# Altium project Fan_Board.PrjPcb
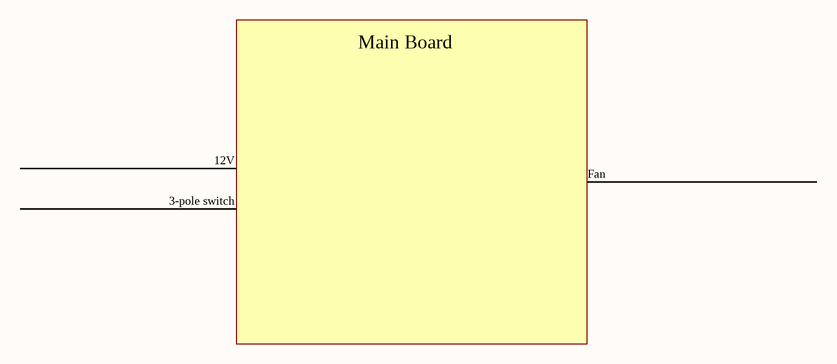
[diagram p0: Block_Diagram.SchDoc]
ProjectAuthor: John Webster and Vlad Hociota; ProjectRevision: 1.0
2 sheets, 9 parts. Net scope: global (net labels, ports and power ports of the same name join across sheets).
Board file: MSXII_Fan_Control.PcbDoc
Sheets:
  Block_Diagram.SchDoc
  Fan_Board.SchDoc

## Sheet Block_Diagram.SchDoc: Block Diagram
size Letter; Organization: Midnight Sun Solar Rayce Car Team; Address1: University of Waterloo; Address2: 200 University Ave W; Address3: Waterloo, ON, Canada; Address4: N2L 3E9; DocumentNumber: 1; SheetNumber: 1; SheetTotal: 5; Website: www.uwmidsun.com

### Notes on the sheet
- Main Board
- 12V
- 3-pole switch
- Fan
- Project:
- Title:
- Size:
- Project Lead:
- Letter
- Revision:
- University of Waterloo
- 200 University Ave W
- Waterloo, ON, Canada
- N2L 3E9
- Date:
- Sheet
- of
- Website:

## Sheet Fan_Board.SchDoc: Fan Control Board
size Letter; DocumentNumber: 3; Revision: 1.0; SheetNumber: 1; SheetTotal: 1; Website: www.uwmidsun.com
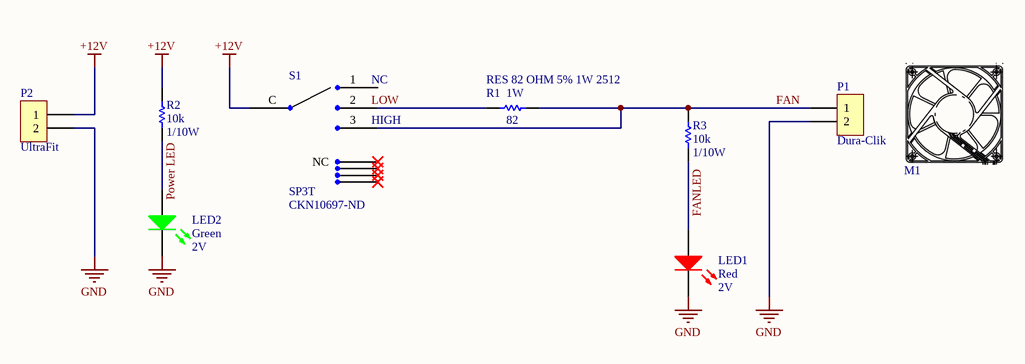
[diagram p1: Fan_Board.SchDoc]

### Parts
LED1  Color: Red  Voltage - Forward (Vf) (Typ): 2V  [LED_0603]  (hidden comment: LED RED CLEAR 2V 0603)
LED2  Color: Green  Voltage - Forward (Vf) (Typ): 2V  [LED_0603]  (hidden comment: LED GREEN CLEAR 2V 0603)
M1  FAN 0.03A 12VDC  (value not drawn)
P1  Dura-Clik  [CONN, 2POS Dura-Click Vertical]
P2  Series: UltraFit  [CONN, 2POS ULTRA-FIT]  (hidden comment: CONN 2POS ULTRA-FIT 0.138")
R1  RES 82 OHM 5% 1W 2512  [RES2512]
R2  Resistance: 10k  Power: 1/10W  [RES, 0603]  (hidden comment: RES 10K OHM 1% 1/10W 0603)
R3  Resistance: 10k  Power: 1/10W  [RES, 0603]  (hidden comment: RES 10K OHM 1% 1/10W 0603)
S1  SP3T  Supplier Part Number 1: CKN10697-ND  [SW ROT RM SERIES]

### Nets
+12V: P2.1 R2.1 S1.C
GND: LED1.2(K) LED2.2(K) P1.2 P2.2
FAN: P1.1 R1.1 R3.1 S1.3
FANLED: LED1.1(A) R3.2
Power LED: LED2.1(A) R2.2
NetR1_2: R1.2 S1.2

Not connected (* = marked no-connect by the designer): S1 1(5) NC*

### Notes on the sheet
- (near S1) NC
- (near S1) HIGH
- Labels drawn without touching a wire or pin: LOW
- Project:
- Title:
- Size:
- Project Lead:
- Letter
- Revision:
- University of Waterloo
- 200 University Ave W
- Waterloo, ON, Canada
- N2L 3E9
- Date:
- Sheet
- of
- Website:
- (in symbol RES 82 OHM 5% 1W 2512) 1W; 82

### Library data of the parts
LED1 = LED RED CLEAR 2V 0603: Red 631nm LED Indication - Discrete 2V 0603 (1608 Metric); Manufacturer: Wurth Electronics Inc.; Manufacturer Part Number: 150060RS75000; Lens Color: Colorless; Millicandela Rating: 250mcd; Lens Style/Size: Rectangle with Flat Top, 1.10mm x 0.70mm; Current - Test: 20mA; Viewing Angle: 140°; Wavelength - Dominant: 625nm; Wavelength - Peak: 630nm; Supplier 1: Digi-Key; RoHS: RoHS Compliant; Category: Optoelectronics; Stock 1: 35521; Pricing 1: 1=0.21, 100=0.1617, 500=0.13964 (CAD); Packaging: Cut Tape (CT); Part Status: Active; Lens Transparency: Clear; Mounting Type: Surface Mount; Features: -; Package / Case: 0603 (1608 Metric); Supplier Device Package: 0603; Size / Dimension: 1.60mm L x 0.80mm W; Height (Max): 0.80mm; ComponentLink1URL: http://katalog.we-online.de/led/datasheet/150060RS75000.pdf; ComponentLink1Description: http://katalog.we-online.de/led/datasheet/150060RS75000.pdf; Supplier Part Number 1: 732-4978-1-ND
LED2 = LED GREEN CLEAR 2V 0603: Green 572nm LED Indication - Discrete 2V 0603 (1608 Metric); Manufacturer: Wurth Electronics Inc.; Manufacturer Part Number: 150060VS75000; Lens Color: Colorless; Millicandela Rating: 40mcd; Lens Style/Size: Rectangle with Flat Top, 1.10mm x 0.70mm; Current - Test: 20mA; Viewing Angle: 140°; Wavelength - Dominant: 570nm; Supplier 1: Digi-Key; RoHS: RoHS Compliant; Category: Optoelectronics; Stock 1: 9408; Pricing 1: 1=0.21, 100=0.1617, 500=0.13964 (CAD); Packaging: Cut Tape (CT); Part Status: Active; Lens Transparency: Clear; Mounting Type: Surface Mount; Wavelength - Peak: 572nm; Features: -; Package / Case: 0603 (1608 Metric); Supplier Device Package: 0603; Size / Dimension: 1.60mm L x 0.80mm W; Height (Max): 0.80mm; ComponentLink1URL: http://katalog.we-online.de/led/datasheet/150060VS75000.pdf; ComponentLink1Description: http://katalog.we-online.de/led/datasheet/150060VS75000.pdf; Supplier Part Number 1: 732-4980-1-ND
M1 = FAN 0.03A 12VDC: FAN 0.03A 12VDC 2 WIRE; Manufacturer: Sunon; Manufacturer Part Number: HA40201V4-1000U-A99; Supplier 1: Digi-Key; RoHS: Yes; Stock 1: 1054; Pricing 1: 1 = 4.34000, 10 = 3.97700, 25 = 3.61520, 50 = 3.34420, 100 = 2.98260, 250 = 2.84708, 500 = 2.66630 (USD); ComponentLink1URL: http://www.sunon.com/uFiles/file/03_products/08-catalog%20download/Sunon%20DC%20Brushless%20Fan%20&%20Blower_(240-E).pdf?src-supplier=Digi-Key; ComponentLink1Description: http://www.sunon.com/uFiles/file/03_products/08-catalog%20download/Sunon%20DC%20Brushless%20Fan%20&%20Blower_(240-E).pdf?src-supplier=Digi-Key; Supplier Part Number 1: 259-1791-ND
P1 = CONN 2POS DURA-CLIK 0.079" VERT: 2 Positions Header, Shrouded Connector 0.079" (2.00mm) Surface Mount, Vertical Tin; Manufacturer: Molex, LLC; Manufacturer Part Number: 5600200220; Style: Board to Cable/Wire; Shrouding: Shrouded - 4 Wall; Number of Positions: 2; Number of Positions Loaded: All; Mated Stacking Heights: 9.3mm; Supplier 1: Digi-Key; RoHS: RoHS Compliant; Category: Connectors, Interconnects; Stock 1: 11912; Pricing 1: 1=1.16, 10=1.012, 25=0.952, 50=0.9122, 100=0.8727, 250=0.79336 (CAD); Packaging: Cut Tape (CT); Part Status: Active; Connector Type: Header; Contact Type: Male Pin; Pitch - Mating: 0.079" (2.00mm); Number of Rows: 1; Row Spacing - Mating: -; Mounting Type: Surface Mount; Termination: Solder; Fastening Type: Latch Lock; Contact Length - Mating: -; Contact Length - Post: -; Overall Contact Length: -; Insulation Height: 0.315" (8.00mm); Contact Shape: Square; Contact Finish - Mating: Tin; Contact Finish Thickness - Mating: -; Contact Finish - Post: Tin; Contact Material: Copper Alloy; Insulation Material: Polyamide (PA), Nylon; Features: Solder Retention; Operating Temperature: -; Ingress Protection: -; Material Flammability Rating: -; Insulation Color: Natural; Current Rating: -; Voltage Rating: -; Contact Finish Thickness - Post: -; Applications: Automotive, Industrial; ComponentLink1URL: http://www.molex.com/pdm_docs/sd/5600200220_sd.pdf; ComponentLink1Description: http://www.molex.com/pdm_docs/sd/5600200220_sd.pdf; Supplier Part Number 1: WM10862CT-ND
P2 = CONN 2POS ULTRA-FIT 0.138": 2 Positions Header, Shrouded Connector 0.138" (3.50mm) Through Hole Gold; Manufacturer 1: Molex, LLC; Manufacturer Part Number 1: 1722861302; Style: Board to Board or Cable; Shrouding: Shrouded - 4 Wall; Number of Positions: 2; Number of Positions Loaded: All; Contact Length - Post: 0.126" (3.20mm); Material Flammability Rating: UL94 V-0; Mated Stacking Heights: 26.99mm; Voltage: 400V; Supplier 1: Digi-Key; Supplier Part Number 1: WM11673-ND; Packaging: Tray; Part Status: Active; Connector Type: Header; Contact Type: Male Pin; Pitch - Mating: 0.138" (3.50mm); Number of Rows: 1; Row Spacing - Mating: -; Mounting Type: Through Hole; Termination: Kinked Pin, Solder; Fastening Type: Latch Holder; Contact Length - Mating: -; Overall Contact Length: -; Insulation Height: 0.465" (11.80mm); Contact Shape: Square; Contact Finish - Mating: Gold; Contact Finish Thickness - Mating: 30µin (0.76µm); Contact Finish - Post: Tin; Contact Material: Copper Alloy; Insulation Material: Liquid Crystal Polymer (LCP); Operating Temperature: -40°C ~ 120°C; Ingress Protection: -; Insulation Color: Black; Current Rating: -; Contact Finish Thickness - Post: 60µin (1.52µm); ComponentLink1URL: http://www.molex.com/pdm_docs/sd/1722861302_sd.pdf; ComponentLink1Description: http://www.molex.com/pdm_docs/sd/1722861302_sd.pdf
R1 = RES 82 OHM 5% 1W 2512: Manufacturer: Panasonic; Manufacturer Part Number: ERJ-P06J820V; Resistance: 82R; Temperature Coefficient: 200ppm/°C; Voltage Rating: 150V; Power Rating: 500mW; RoHS: Yes; Mount: Surface Mount; Case/Package: 0805; Contact Plating: Tin; Case Code (Imperial): 0805; Case Code (Metric): 2012; Min Operating Temperature: -55°C; Max Operating Temperature: 155°C; Tolerance: 5%; Composition: Thick Film; Packaging: Tape and Reel; Package Quantity: 1; Number of Terminations: 2; Max Power Dissipation: 500mW; Voltage Rating (DC): 150V; Features: Automotive AEC-Q200; Length: 0.079inch; Height: 0.028inch; Width: 1.2mm; Radiation Hardening: No; Lead Free: Lead Free; ComponentLink1URL: https://datasheet.ciiva.com/24043/aoa0000ce4-64075-24043253.pdf?src-supplier=Mouser; ComponentLink1Description: https://datasheet.ciiva.com/24043/aoa0000ce4-64075-24043253.pdf?src-supplier=Mouser; ComponentLink2URL: https://datasheet.ciiva.com/30128/aoa0000ce4-30128246.pdf?src-supplier=Onlinecomponents.com; ComponentLink2Description: https://datasheet.ciiva.com/30128/aoa0000ce4-30128246.pdf?src-supplier=Onlinecomponents.com; ComponentLink3URL: https://datasheet.ciiva.com/9187/aoa0000ce4-9187530.pdf?src-supplier=Avnet; ComponentLink3Description: https://datasheet.ciiva.com/9187/aoa0000ce4-9187530.pdf?src-supplier=Avnet; Stock 1: 18769; Pricing 1: 1 = 0.30000, 10 = 0.25400, 100 = 0.09930, 1000 = 0.04158 (USD); Military Standard: Not; Depth: 3.2mm; ComponentLink4URL: http://components.arrow.com/part/dataview/46840453S9826188N1174?src-supplier=Arrow; ComponentLink4Description: http://components.arrow.com/part/dataview/46840453S9826188N1174?src-supplier=Arrow; ComponentLink5URL: https://www.verical.com/server-webapp/html/getDatasheet?partID=363751&src-supplier=Verical; ComponentLink5Description: https://www.verical.com/server-webapp/html/getDatasheet?partID=363751&src-supplier=Verical; ComponentLink6URL: https://www.seielect.com/Catalog/SEI-RMCF_RMCP.pdf?src-supplier=Digi-Key; ComponentLink6Description: https://www.seielect.com/Catalog/SEI-RMCF_RMCP.pdf?src-supplier=Digi-Key; ComponentLink7URL: https://www.seielect.com/catalog/SEI-RMCF_RMCP.pdf?src-supplier=Avnet; ComponentLink7Description: https://www.seielect.com/catalog/SEI-RMCF_RMCP.pdf?src-supplier=Avnet; ComponentLink8URL: http://www.seielect.com/Catalog/SEI-RMCF_RMCP.pdf?src-supplier=Future+Electronics; ComponentLink8Description: http://www.seielect.com/Catalog/SEI-RMCF_RMCP.pdf?src-supplier=Future+Electronics; Supplier 1: Digi-Key; Supplier Part Number 1: RMCF2512JT82R0CT-ND
R2 R3 = RES 10K OHM 1% 1/10W 0603: RES SMD 10K OHM 1% 1/10W 0603; Manufacturer 1: Yageo; Manufacturer Part Number 1: RC0603FR-0710KL; Temperature Coefficient: ±100ppm/°C; Supplier 1: Digi-Key; Supplier Part Number 1: 311-10.0KHRCT-ND; Packaging: Cut Tape (CT); Part Status: Active; Composition: Thick Film; Operating Temperature: -55°C ~ 155°C; Package / Case: 0603 (1608 Metric); Supplier Device Package: 0603; Size / Dimension: 0.063" L x 0.031" W (1.60mm x 0.80mm); Height - Seated (Max): 0.022" (0.55mm); Failure Rate: -; ComponentLink1URL: http://www.yageo.com/documents/recent/PYu-RC_Group_51_RoHS_L_7.pdf; ComponentLink1Description: http://www.yageo.com/documents/recent/PYu-RC_Group_51_RoHS_L_7.pdf; Tolerance: ±1%
S1 = SW ROT SP3T-NO 0.5A 24VDC: SWITCH ROTARY 3POS 500MA 24V; Manufacturer: ITT C&K; Manufacturer Part Number: RM103772BCB; Supplier 1: Digi-Key; Stock 1: 22; Pricing 1: 1 = 2.27000, 10 = 2.17400, 25 = 1.98520, 50 = 1.89080, 100 = 1.70160, 250 = 1.55984, 500 = 1.51258, 1000 = 1.46531, 5000 = 1.37077 (USD)